# EAGLE design Variable_Load (EAGLE 7.7.0)
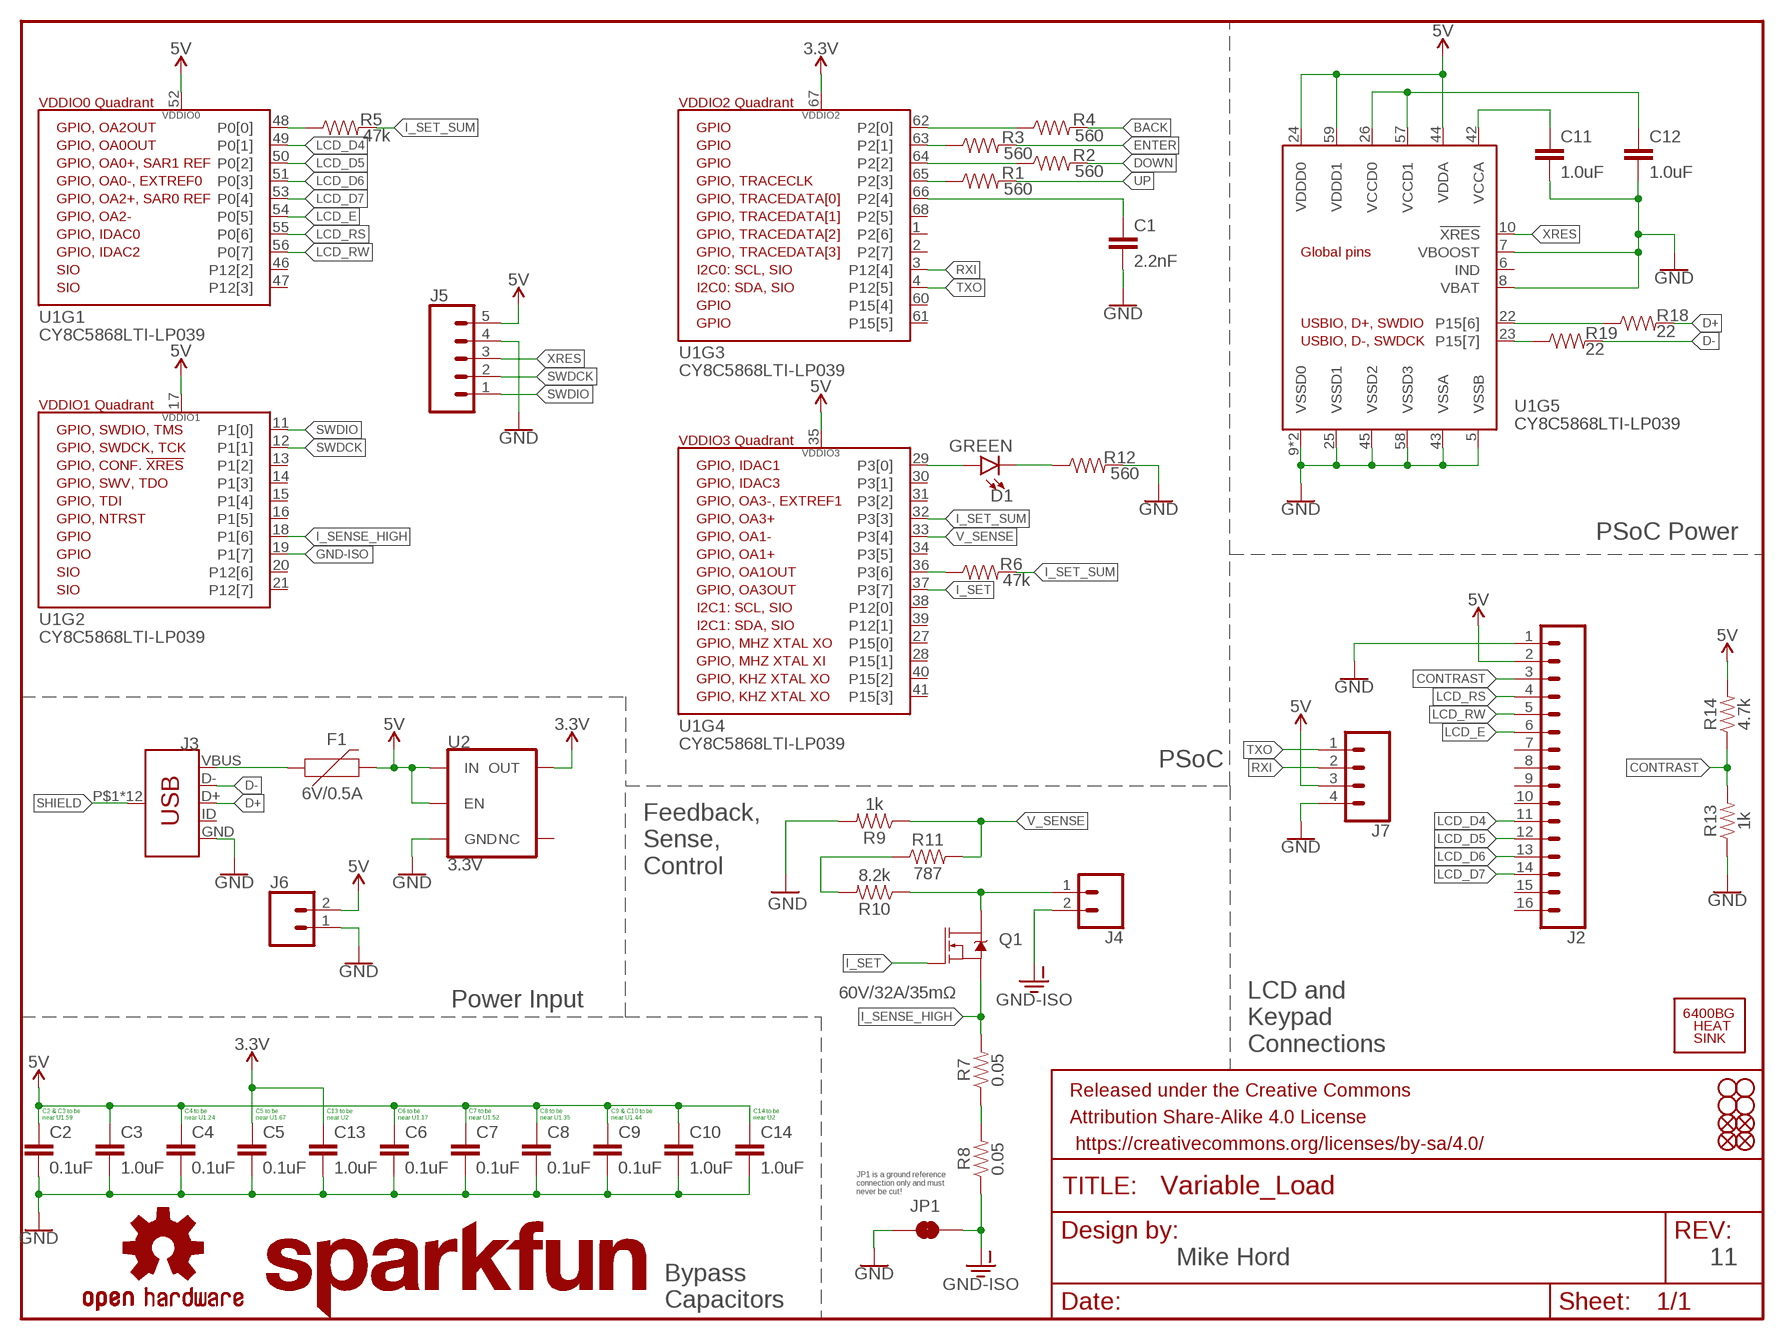
[diagram p0: schematic, sheet 1]

## Parts
C1  2.2nF  2.2NF/2200PF-0603-50V-10%  [0603]
C2  0.1uF  0.1UF-0402-16V-10%  [0402]
C3  1.0uF  1.0UF-0402-16V-10%  [0402]
C4  0.1uF  0.1UF-0402-16V-10%  [0402]
C5  0.1uF  0.1UF-0402-16V-10%  [0402]
C6  0.1uF  0.1UF-0402-16V-10%  [0402]
C7  0.1uF  0.1UF-0402-16V-10%  [0402]
C8  0.1uF  0.1UF-0402-16V-10%  [0402]
C9  0.1uF  0.1UF-0402-16V-10%  [0402]
C10  1.0uF  1.0UF-0402-16V-10%  [0402]
C11  1.0uF  1.0UF-0402-16V-10%  [0402]
C12  1.0uF  1.0UF-0402-16V-10%  [0402]
C13  1.0uF  1.0UF-0402-16V-10%  [0402]
C14  1.0uF  1.0UF-0402-16V-10%  [0402]
D1  GREEN  LED1206-BOTTOM  [LED-1206-BOTTOM]
F1  6V/0.5A  PPTC_HALF-AMP  [1206]
FD1  FIDUCIAL1X2  [FIDUCIAL-1X2]
FD2  FIDUCIAL1X2  [FIDUCIAL-1X2]
FD3  FIDUCIAL1X2  [FIDUCIAL-1X2]
FD4  FIDUCIAL1X2  [FIDUCIAL-1X2]
FRAME1  FRAME-LETTER  [CREATIVE_COMMONS]
H1  6400BG_HEATSINK  [6400BG_HEATSINK]
H2  STAND-OFF  [STAND-OFF]
H3  STAND-OFF  [STAND-OFF]
H4  STAND-OFF  [STAND-OFF]
H5  STAND-OFF  [STAND-OFF]
J2  CONN_16  [1X16]
J3  AMP FCI 10103594-0001LF  USB_MICRO-B_HALF_PTH  [USB-MICROB-PTH]
J4  CONN_023.5MM_LOCK  [SCREWTERMINAL-3.5MM-2_LOCK]
J5  CONN_05  [1X05]
J6  CONN_02  [1X02]
J7  CONN_04  [1X04]
JP1  JUMPER-SMT_2_NC_TRACE_NO-SILK  [SMT-JUMPER_2_NC_TRACE_NO-SILK]
LOGO1  OSHW-LOGOM  [OSHW-LOGO-M]
LOGO2  SFE_LOGO_NAME.3_INCH  [SFE_LOGO_NAME_.3]
LOGO3  SFE_LOGO_NAME.3_INCH  [SFE_LOGO_NAME_.3]
Q1  60V/32A/35mΩ  MOSFET-NCH-FQP30N06L  [TO220V]
R1  560  560OHM_0402_1%  [0402]
R2  560  560OHM_0402_1%  [0402]
R3  560  560OHM_0402_1%  [0402]
R4  560  560OHM_0402_1%  [0402]
R5  47k  47KOHM-0603-1/10W-1%  [0603]
R6  47k  47KOHM-0603-1/10W-1%  [0603]
R7  0.05  0.05OHM-2512-3W-1%  [2512]
R8  0.05  0.05OHM-2512-3W-1%  [2512]
R9  1k  1KOHM-0603-1/10W-1%  [0603]
R10  8.2k  8.2KOHM-0603-1/10W-5%  [0603]
R11  787  787OHM-0603-1/10W-1%  [0603]
R12  560  560OHM_0402_1%  [0402]
R13  1k  1KOHM-0603-1/10W-1%  [0603]
R14  4.7k  4.7KOHM-0603-1/10W-1%  [0603]
R18  22  22OHM1/10W1%(0402)  [0402-RES]
R19  22  22OHM1/10W1%(0402)  [0402-RES]
U1  CY8C5868LTI-LP039  PSOC_5LP_68QFN  [QFN-68]
U2  3.3V  V_REG_AP2112K-3.3V  [SOT23-5]

## Nets
3.3V: C5.1 C13.1 U1.67(VDDIO2) U2.5(OUT)
5V: C2.1 C3.1 C4.1 C6.1 C7.1 C8.1 C9.1 C10.1 C14.1 F1.2 J2.2 J5.5 J6.2 J7.3 R14.2 U1.17(VDDIO1) U1.24(VDDD0) U1.35(VDDIO3) U1.44(VDDA) U1.52(VDDIO0) U1.59(VDDD1) U2.1(IN) U2.3(EN)
BACK: R4.2
CONTRAST: J2.3 R13.2 R14.1
D+: J3.D+ R18.2
D-: J3.D- R19.2
DOWN: R2.2
ENTER: R3.2
GND: C1.2 C2.2 C3.2 C4.2 C5.2 C6.2 C7.2 C8.2 C9.2 C10.2 C11.2 C12.2 C13.2 C14.2 J2.1 J3.GND J5.4 J6.1 J7.4 JP1.1 R9.2 R12.2 R13.1 U1.5(VSSB) U1.7(VBOOST) U1.8(VBAT) U1.9(VSSD0) U1.25(VSSD1) U1.43(VSSA) U1.45(VSSD2) U1.58(VSSD3) U1.69(VSSD0) U2.2(GND)
GND-ISO: J4.2 JP1.2 R8.P$1 U1.19(P1[7])
I_SENSE_HIGH: Q1.3(S) R7.P$2 U1.18(P1[6])
I_SET: Q1.1(G) U1.37(P3[7])
I_SET_SUM: R5.2 R6.2 U1.32(P3[3])
LCD_D4: J2.11 U1.49(P0[1])
LCD_D5: J2.12 U1.50(P0[2])
LCD_D6: J2.13 U1.51(P0[3])
LCD_D7: J2.14 U1.53(P0[4])
LCD_E: J2.6 U1.54(P0[5])
LCD_RS: J2.4 U1.55(P0[6])
LCD_RW: J2.5 U1.56(P0[7])
N$1: R1.1 U1.65(P2[3])
N$2: R2.1 U1.64(P2[2])
N$3: R3.1 U1.63(P2[1])
N$4: R4.1 U1.62(P2[0])
N$5: C1.1 U1.66(P2[4])
N$6: C12.1 U1.26(VCCD0) U1.57(VCCD1)
N$7: C11.1 U1.42(VCCA)
N$8: R18.1 U1.22(P15[6])
N$9: R19.1 U1.23(P15[7])
N$10: R5.1 U1.48(P0[0])
N$11: R6.1 U1.36(P3[6])
N$12: D1.A U1.29(P3[0])
N$13: D1.C R12.1
N$14: F1.1 J3.VBUS
N$15: J4.1 Q1.2(D) R10.1
N$16: R10.2 R11.1
N$18: R7.P$1 R8.P$2
RXI: J7.2 U1.3(P12[4])
SHIELD: J3.P$1(SHIELD) J3.P$2(SHIELD) J3.P$3(SHIELD) J3.P$4(SHIELD) J3.P$6(SHIELD) J3.P$8(SHIELD) J3.P$10(SHIELD) J3.P$12(SHIELD) J3.SHEILD2(SHIELD) J3.SHIELD J3.SHIELD3(SHIELD) J3.SHIELD4(SHIELD)
SWDCK: J5.2 U1.12(P1[1])
SWDIO: J5.1 U1.11(P1[0])
TXO: J7.1 U1.4(P12[5])
UP: R1.2
V_SENSE: R9.1 R11.2 U1.33(P3[4])
XRES: J5.3 U1.10(!XRES)
Unconnected: J2.7 J2.8 J2.9 J2.10 J2.15 J2.16 J3.ID U1.1(P2[6]) U1.2(P2[7]) U1.6(IND) U1.13(P1[2]) U1.14(P1[3]) U1.15(P1[4]) U1.16(P1[5]) U1.20(P12[6]) U1.21(P12[7]) U1.27(P15[0]) U1.28(P15[1]) U1.30(P3[1]) U1.31(P3[2]) U1.34(P3[5]) U1.38(P12[0]) U1.39(P12[1]) U1.40(P15[2]) U1.41(P15[3]) U1.46(P12[2]) U1.47(P12[3]) U1.60(P15[4]) U1.61(P15[5]) U1.68(P2[5]) U2.4(NC)

## Notes on the sheet
- PSoC Power
- PSoC
- Feedback,
  Sense,
  Control
- Power Input
- LCD and
  Keypad
  Connections
- C2 & C3 to be
  near U1.59
- C4 to be
  near U1.24
- C5 to be
  near U1.67
- C13 to be
  near U2
- C6 to be
  near U1.17
- C7 to be
  near U1.52
- C8 to be
  near U1.35
- C9 & C10 to be
  near U1.44
- C14 to be
  near U2
- JP1 is a ground reference 
  connection only and must
  never be cut!
- Mike Hord | 11
- Bypass
  Capacitors

## Library data of the parts
C1 = SparkFun-Capacitors:2.2NF/2200PF: 2.2nF/2,200pF ceramic capacitors A capacitor is a passive two-terminal electrical component used to store electrical energy temporarily in an electric field.; PROD_ID: CAP-07877
C2 C4-C9 = SparkFun-Capacitors:0.1UF: 0.1µF ceramic capacitors A capacitor is a passive two-terminal electrical component used to store electrical energy temporarily in an electric field.; PROD_ID: CAP-12416
C3 C10-C14 = SparkFun-Capacitors:1.0UF: 1µF ceramic capacitors A capacitor is a passive two-terminal electrical component used to store electrical energy temporarily in an electric field.; PROD_ID: CAP-12417
D1 = SparkFun-LED:LED: LED (Generic) Standard schematic elements and footprints for 5mm, 3mm, 1206, and 0603 sized LEDs. Generic LEDs with no color specified.; PROD_ID: DIO-11076
F1 = SparkFun-Fuses:PPTC: Resettable Fuse PPTC Resettable Fuse. Really a sort of resistor with a polymeric positive temperature coefficient whose resistance increases dramatically with an increase in temperature. When heated by the power passing through the resistance rises causing the current to be limited, protecting the circuit. This is achieved by the transition of the polymer from a crystalline to an amorphous state where the conductive carbon separates breaking the conductive pathways found in the cool crystalline structure. When a PPTC cools back down it resumes conducting letting the circuit turn back on. SparkFun Products: SparkFun RedBoard - Programmed with Arduino <https://www.sparkfun.com/products/12757> Pro Micro - 5V/16MHz <https://www.sparkfun.com/products/12640> Arduino Pro 328 - 5V/16MHz <https://www.sparkfun.com/products/10915> MP3 Trigger <https://www.sparkfun.com/products/13720>; PROD_ID: RES-08585
FD1-FD4 = SparkFun-Aesthetics:FIDUCIAL: Fiducial Alignment Points Point-of-reference for pick-and-place machines and other optical instruments.
FRAME1 = SparkFun-Aesthetics:FRAME-LETTER: Schematic Frame - Letter Standard 8.5x11 US Letter frame
H1 = SparkFun-Hardware:6400BG_HEATSINK: 6400BG Heatsink - Multiwatt Package This beefy heatsink is designed to dissipate a lot of heat! The 6400BG heatsink fits TO-220, TO-218, TO-247, and Multiwatt packages - which means it’s a great fit for the STA540 <http://www.sparkfun.com/commerce/product_info.php?products_id=9557>, L298N <http://www.sparkfun.com/commerce/product_info.php?products_id=9479>, and all of our T-220 package voltage regulators <http://www.sparkfun.com/commerce/advanced_search_result.php?keywords=TO-220+COM&x=21&y=16&search_section=products>. SparkFun Products Heat Sink - Multiwatt Package <https://www.sparkfun.com/products/9576> (PRT-09576); PROD_ID: COMP-09537; SF_SKU: PRT-09576
H2-H5 = SparkFun-Hardware:STAND-OFF: Stand Off Drill holes for mechanically mounting via screws, standoffs, etc. Note: Use the keepout ring to avoid running the screw head into surrounding components. Variant Overviews STAND-OFF - Mechanical footprint for a #4 phillips button head screw. STAND-OFF-TIGHT - Mechanical footprint for a #4 phillips button head screw, Example SparkFun Products Screw - Phillips Head (1/4", 4-40, 10 pack) <https://www.sparkfun.com/products/10453> (PRT-10453) Screw - Phillips Head (1/2", 4-40, 10 pack) <https://www.sparkfun.com/products/10452> (PRT-10452) Screw - Phillips Head (3/4", 4-40, 10 pack) <https://www.sparkfun.com/products/10451> (PRT-10451) Screw - Phillips Head (1", 4-40, 10 pack) <https://www.sparkfun.com/products/10450> (PRT-10450)
J2 = SparkFun-Connectors:CONN_16: Multi connection point. Often used as Generic Header-pin footprint for 0.1 inch spaced/style header connections On any of the 0.1 inch spaced packages, you can populate with these: Break Away Headers - Straight <https://www.sparkfun.com/products/116> (PRT-00116) Break Away Male Headers - Right Angle <https://www.sparkfun.com/products/553> (PRT-00553) Female Headers <https://www.sparkfun.com/products/115> (PRT-00115) Break Away Headers - Machine Pin <https://www.sparkfun.com/products/117> (PRT-00117) Break Away Female Headers - Swiss Machine Pin <https://www.sparkfun.com/products/743> (PRT-00743) For SCREWTERMINALS and SPRING TERMINALS visit here: Screw Terimnals on SparkFun.com <https://www.sparkfun.com/search/results?term=Screw+Terminals> (5mm/3.5mm/2.54mm spacing) This device is also useful as a general connection point to wire up your design to another part of your project. Our various solder wires solder well into these plated through hole pads. Hook-Up Wire - Assortment (Stranded, 22 AWG) <https://www.sparkfun.com/products/11375> (PRT-11375) Hook-Up Wire - Assortment (Solid Core, 22 AWG) <https://www.sparkfun.com/products/11367> (PRT-11367) View the entire wire category on our website here <https://www.sparkfun.com/categories/141> Special notes: Molex polarized connector foot print use with SKU : PRT-08231 with associated crimp pins and housings. 1MM SMD Version SKU: PRT-10208 NOTES ON THE VARIANTS LOCK and LOCK_LONGPADS... This footprint was designed to help hold the alignment of a through-hole component (i.e. 6-pin header) while soldering it into place. You may notice that each hole has been shifted either up or down by 0.005 of an inch from it's more standard position (which is a perfectly straight line). This slight alteration caused the pins (the squares in the middle) to touch the edges of the holes. Because they are alternating, it causes a "brace" to hold the component in place. 0.005 has proven to be the perfect amount of "off-center" position when using our standard breakaway headers. Although looks a little odd when you look at the bare footprint, once you have a header in there, the alteration is very hard to notice. Also,if you push a header all the way into place, it is covered up entirely on the bottom side.
J3 = SparkFun-Connectors:USB_MICRO-B: USB Type Micro-B Connector Male/female and PTH/SMT variants SparkFun Products: SparkFun microB USB Breakout <https://www.sparkfun.com/products/12035> SparkFun USB microB Plug Breakout <https://www.sparkfun.com/products/10031> SparkFun ESP8266 Thing <https://www.sparkfun.com/products/13231>; PROD_ID: CONN-13711
J4 = SparkFun-Connectors:CONN_02: Multi connection point. Often used as Generic Header-pin footprint for 0.1 inch spaced/style header connections On any of the 0.1 inch spaced packages, you can populate with these: Break Away Headers - Straight <https://www.sparkfun.com/products/116> (PRT-00116) Break Away Male Headers - Right Angle <https://www.sparkfun.com/products/553> (PRT-00553) Female Headers <https://www.sparkfun.com/products/115> (PRT-00115) Break Away Headers - Machine Pin <https://www.sparkfun.com/products/117> (PRT-00117) Break Away Female Headers - Swiss Machine Pin <https://www.sparkfun.com/products/743> (PRT-00743) For SCREWTERMINALS and SPRING TERMINALS visit here: Screw Terimnals on SparkFun.com <https://www.sparkfun.com/search/results?term=Screw+Terminals> (5mm/3.5mm/2.54mm spacing) This device is also useful as a general connection point to wire up your design to another part of your project. Our various solder wires solder well into these plated through hole pads. Hook-Up Wire - Assortment (Stranded, 22 AWG) <https://www.sparkfun.com/products/11375> (PRT-11375) Hook-Up Wire - Assortment (Solid Core, 22 AWG) <https://www.sparkfun.com/products/11367> (PRT-11367) View the entire wire category on our website here <https://www.sparkfun.com/categories/141> Special notes: Molex polarized connector foot print use with: PRT-08233 with associated crimp pins and housings. 2.54_SCREWTERM for use with PRT-10571. 3.5mm Screw Terminal footprints for PRT-08084 5mm Screw Terminal footprints for use with PRT-08432; PROD_ID: CONN-08399
J5 = SparkFun-Connectors:CONN_05: Multi connection point. Often used as Generic Header-pin footprint for 0.1 inch spaced/style header connections On any of the 0.1 inch spaced packages, you can populate with these: Break Away Headers - Straight <https://www.sparkfun.com/products/116> (PRT-00116) Break Away Male Headers - Right Angle <https://www.sparkfun.com/products/553> (PRT-00553) Female Headers <https://www.sparkfun.com/products/115> (PRT-00115) Break Away Headers - Machine Pin <https://www.sparkfun.com/products/117> (PRT-00117) Break Away Female Headers - Swiss Machine Pin <https://www.sparkfun.com/products/743> (PRT-00743) For SCREWTERMINALS and SPRING TERMINALS visit here: Screw Terimnals on SparkFun.com <https://www.sparkfun.com/search/results?term=Screw+Terminals> (5mm/3.5mm/2.54mm spacing) This device is also useful as a general connection point to wire up your design to another part of your project. Our various solder wires solder well into these plated through hole pads. Hook-Up Wire - Assortment (Stranded, 22 AWG) <https://www.sparkfun.com/products/11375> (PRT-11375) Hook-Up Wire - Assortment (Solid Core, 22 AWG) <https://www.sparkfun.com/products/11367> (PRT-11367) View the entire wire category on our website here <https://www.sparkfun.com/categories/141> Special notes: Molex polarized connector foot print use with SKU : PRT-08231 with associated crimp pins and housings. 1MM SMD Version SKU: PRT-10208
J6 = SparkFun-Connectors:CONN_02: Multi connection point. Often used as Generic Header-pin footprint for 0.1 inch spaced/style header connections On any of the 0.1 inch spaced packages, you can populate with these: Break Away Headers - Straight <https://www.sparkfun.com/products/116> (PRT-00116) Break Away Male Headers - Right Angle <https://www.sparkfun.com/products/553> (PRT-00553) Female Headers <https://www.sparkfun.com/products/115> (PRT-00115) Break Away Headers - Machine Pin <https://www.sparkfun.com/products/117> (PRT-00117) Break Away Female Headers - Swiss Machine Pin <https://www.sparkfun.com/products/743> (PRT-00743) For SCREWTERMINALS and SPRING TERMINALS visit here: Screw Terimnals on SparkFun.com <https://www.sparkfun.com/search/results?term=Screw+Terminals> (5mm/3.5mm/2.54mm spacing) This device is also useful as a general connection point to wire up your design to another part of your project. Our various solder wires solder well into these plated through hole pads. Hook-Up Wire - Assortment (Stranded, 22 AWG) <https://www.sparkfun.com/products/11375> (PRT-11375) Hook-Up Wire - Assortment (Solid Core, 22 AWG) <https://www.sparkfun.com/products/11367> (PRT-11367) View the entire wire category on our website here <https://www.sparkfun.com/categories/141> Special notes: Molex polarized connector foot print use with: PRT-08233 with associated crimp pins and housings. 2.54_SCREWTERM for use with PRT-10571. 3.5mm Screw Terminal footprints for PRT-08084 5mm Screw Terminal footprints for use with PRT-08432
J7 = SparkFun-Connectors:CONN_04: Multi connection point. Often used as Generic Header-pin footprint for 0.1 inch spaced/style header connections On any of the 0.1 inch spaced packages, you can populate with these: Break Away Headers - Straight <https://www.sparkfun.com/products/116> (PRT-00116) Break Away Male Headers - Right Angle <https://www.sparkfun.com/products/553> (PRT-00553) Female Headers <https://www.sparkfun.com/products/115> (PRT-00115) Break Away Headers - Machine Pin <https://www.sparkfun.com/products/117> (PRT-00117) Break Away Female Headers - Swiss Machine Pin <https://www.sparkfun.com/products/743> (PRT-00743) For SCREWTERMINALS and SPRING TERMINALS visit here: Screw Terimnals on SparkFun.com <https://www.sparkfun.com/search/results?term=Screw+Terminals> (5mm/3.5mm/2.54mm spacing) This device is also useful as a general connection point to wire up your design to another part of your project. Our various solder wires solder well into these plated through hole pads. Hook-Up Wire - Assortment (Stranded, 22 AWG) <https://www.sparkfun.com/products/11375> (PRT-11375) Hook-Up Wire - Assortment (Solid Core, 22 AWG) <https://www.sparkfun.com/products/11367> (PRT-11367) View the entire wire category on our website here <https://www.sparkfun.com/categories/141> Special notes: Molex polarized connector foot print use with SKU : PRT-08231 with associated crimp pins and housings. 1MM SMD Version SKU: PRT-10208; PROD_ID: CONN-09696
JP1 = SparkFun-Jumpers:JUMPER-SMT_2_NC_TRACE: Normally closed trace jumper This jumper has a trace between two pads so it's normally closed (NC). Use a razor knife to open the connection. For best results follow the IPC guidelines for cutting traces: Cutout at least 0.063 mm (0.005 in). Remove all loose material to clean up the cut area. Seal the cut with an approved epoxy. Reapply solder to reclose the connection.
LOGO1 = SparkFun-Aesthetics:OSHW-LOGO: Open-Source Hardware (OSHW) Logo This logo indicates the piece of hardware it is found on incorporates a OSHW license and/or adheres to the definition of open source hardware found here: http://freedomdefined.org/OSHW
LOGO2 LOGO3 = SparkFun-Aesthetics:SFE_LOGO_NAME: SparkFun Font Logo This is the SparkFun name logo. The logo on the schematic will always be the same size; the package variant is the height of the flame part of the logo (or the height the flame would be, if it were drawn). Default layer for the logo on the board is tSilk.
Q1 = SparkFun-DiscreteSemi:MOSFET-NCH: N-channel MOSFETs Voltage controlled devices that allow control of high current outputs. SparkFun Products: SparkFun OpenScale <https://www.sparkfun.com/products/13261> SparkFun Digital Sandbox <https://www.sparkfun.com/products/12651> SparkFun Monster Moto Shield <https://www.sparkfun.com/products/10182> SparkFun MOSFET Power Controller <https://www.sparkfun.com/products/11214>; PROD_ID: TRANS-10060
R1-R4 R12 = SparkFun-Resistors:560OHM; PROD_ID: RES-13766
R5 R6 = SparkFun-Resistors:47KOHM: 47kΩ resistor A resistor is a passive two-terminal electrical component that implements electrical resistance as a circuit element. Resistors act to reduce current flow, and, at the same time, act to lower voltage levels within circuits. - Wikipedia; PROD_ID: RES-07871
R7 R8 = SparkFun-Resistors:0.05OHM: 0.05Ω resistor A resistor is a passive two-terminal electrical component that implements electrical resistance as a circuit element. Resistors act to reduce current flow, and, at the same time, act to lower voltage levels within circuits. - Wikipedia; PROD_ID: RES-13771
R9 R13 = SparkFun-Resistors:1KOHM: 1kΩ resistor A resistor is a passive two-terminal electrical component that implements electrical resistance as a circuit element. Resistors act to reduce current flow, and, at the same time, act to lower voltage levels within circuits. - Wikipedia; PROD_ID: RES-07856
R10 = SparkFun-Resistors:8.2KOHM: 8.2kΩ resistor A resistor is a passive two-terminal electrical component that implements electrical resistance as a circuit element. Resistors act to reduce current flow, and, at the same time, act to lower voltage levels within circuits. - Wikipedia; PROD_ID: RES-10646
R11 = SparkFun-Resistors:787OHM: 787Ω resistor A resistor is a passive two-terminal electrical component that implements electrical resistance as a circuit element. Resistors act to reduce current flow, and, at the same time, act to lower voltage levels within circuits. - Wikipedia; PROD_ID: RES-11228
R14 = SparkFun-Resistors:4.7KOHM: 4.7kΩ resistor A resistor is a passive two-terminal electrical component that implements electrical resistance as a circuit element. Resistors act to reduce current flow, and, at the same time, act to lower voltage levels within circuits. - Wikipedia; PROD_ID: RES-07857
R18 R19 = SparkFun-Resistors:22OHM1/10W1%(0402); PROD_ID: RES-12427
U1 = SparkFun-IC-Microcontroller:PSOC_5LP_68QFN: PSoC5LP 68-QFN package CY8C5868LTI-LP039 PSOC 5LP 256K/64K/2K 80MHz Datasheet <https://cdn.sparkfun.com/datasheets/Dev/ARM/CY8C58LP_001-84932_0H_V.pdf> SparkFun Products FreeSoC2 Development Board - PSoC5LP <https://www.sparkfun.com/products/13229> (DEV-13229) -- Involved with change to new unposted revision; PROD_ID: IC-12391
U2 = SparkFun-IC-Power:V_REG_AP2112: AP2112 - 600mA CMOS LDO Regulator w/ Enable The AP2112 is CMOS process low dropout linear regulator with enable function, the regulator delivers a guaranteed 600mA (min.) continuous load current. Features Output Voltage Accuracy: ±1.5% Output Current: 600mA (Min.) Foldback Short Current Protection: 50mA Enable Function to Turn ON/OFF VOUT Low Dropout Voltage (3.3V): 250mV (Typ.) @IOUT=600mA Excellent Load Regulation: 0.2%/A (Typ.) Excellent Line Regulation: 0.02%/V (Typ.) Low Quiescent Current: 55μA (Typ.) Low Standby Current: 0.01μA (Typ.) Low Output Noise: 50μVRMS PSRR: 100Hz -65dB, 1kHz -65dB OTSD Protection Stable with 1.0μF Flexible Cap: Ceramic, Tantalum and Aluminum Electrolytic Operation Temperature Range: -40°C to 85°C ESD: MM 400V, HBM 4000V; PROD_ID: VREG-12457

## Board
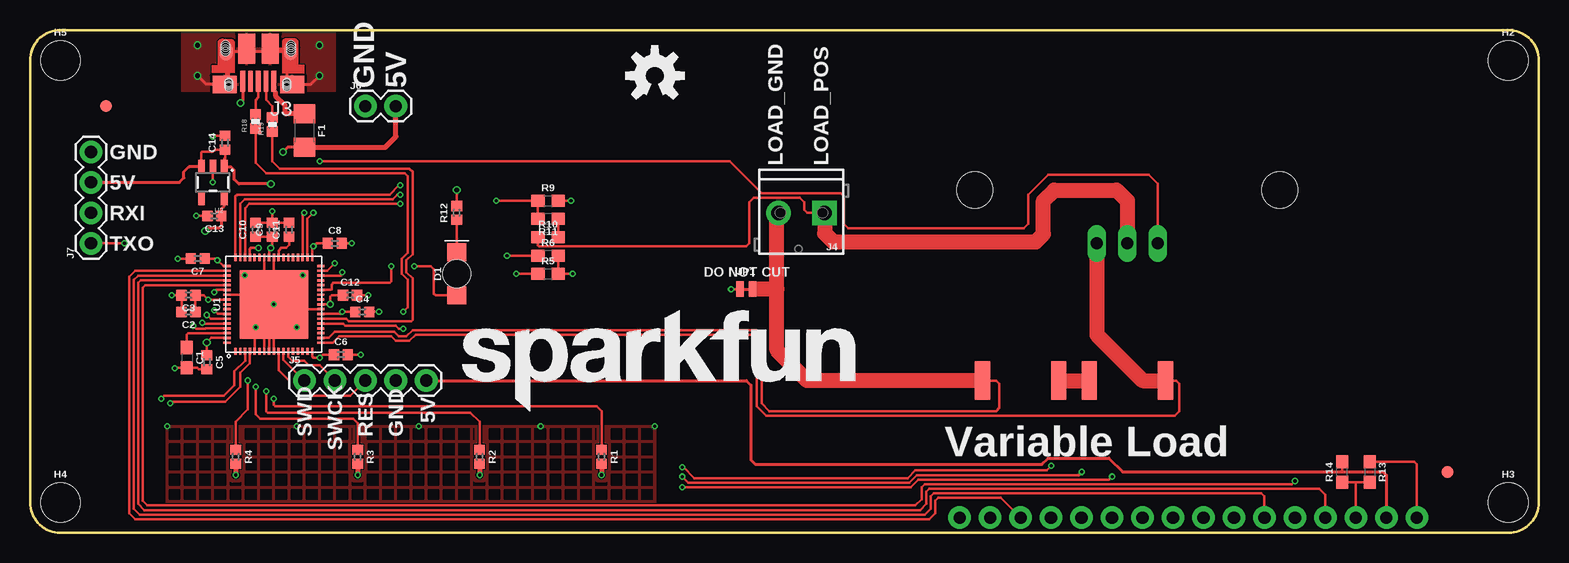
[diagram p1: board, top side]
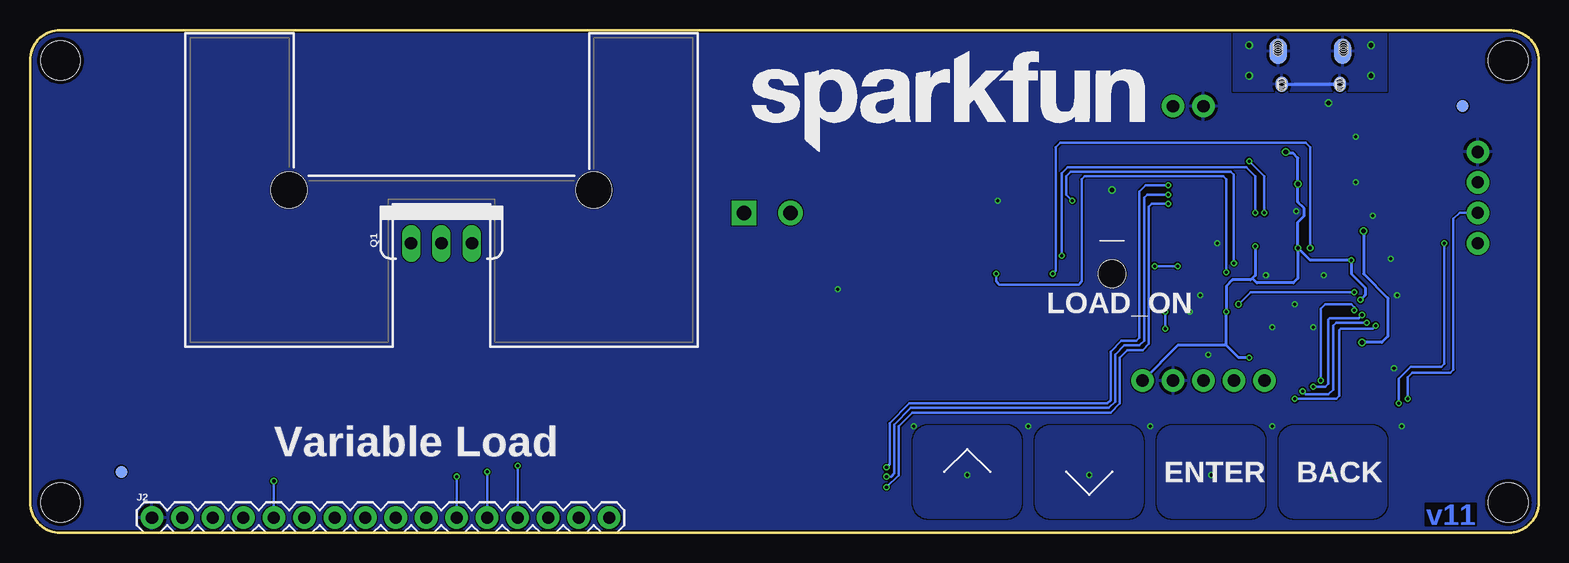
[diagram p2: board, bottom side, seen from below]

Size 125.73 x 41.91 mm. Coordinates in mm from the lower left corner, seen from the top.
Outline: 2.54,0 123.19,0 arc90 125.73,2.54 125.73,39.37 arc90 123.19,41.91 2.54,41.91 arc90 0,39.37 0,2.54 arc90 2.54,0
Copper layers (1*16): Top 0.035mm / dielectric 1.5mm / Bottom 0.035mm
Design rules "SparkFun-2-layer-FAB-LIMIT": minimum track width 4mil, minimum drill 6mil, track to track 4mil, track to pad 4mil, pad to pad 4mil, via to via 4mil, smd to smd 4mil, copper to edge 4mil, drill to drill 4mil, minimum pad ring 5mil, minimum via ring 5mil, stop-mask expansion 4mil, vias tented up to drill 25mil, thermal gap 10mil
tRestrict: 1 lines

### Footprints (pad centres in the part's own frame; a part is rotated, then mirrored left to right if it is on the bottom)
0603 = smd 1.1 x 1: 1 -0.85,0; 2 0.85,0
0402 = smd 0.85 x 0.9: 1 -0.58,0; 2 0.58,0
LED-1206-BOTTOM = smd 1.5 x 1.6: A -1.8,0; C 1.8,0 | hole 2.3: 0,0
1206 = smd 1.6 x 1.8: 1 -1.4,0; 2 1.4,0
FIDUCIAL-1X2 = smd 1 x 1: 1 0,0
6400BG_HEATSINK = hole 2.997: -12.7,0; 12.7,0
STAND-OFF = hole 3.302: 0,0
1X16 = drill 1.016 pad 1.88: 1 0,0; 2 2.54,0; 3 5.08,0; 4 7.62,0; 5 10.16,0; 6 12.7,0; 7 15.24,0; 8 17.78,0; 9 20.32,0; 10 22.86,0; 11 25.4,0; 12 27.94,0; 13 30.48,0; 14 33.02,0; 15 35.56,0; 16 38.1,0
USB-MICROB-PTH = smd 0.4 x 1.75: D+ 0.031,1.331; D- -0.619,1.331; GND 1.331,1.331; ID 0.681,1.331; VBUS -1.269,1.331 | smd 1.4 x 2.1 bottom: P$1 2.701,-1.142; P$3 -2.659,-1.144 | smd 1 x 1.3: P$2 2.487,1.594; P$6 -2.368,1.604 | smd 1 x 1.3 bottom: P$4 -2.368,1.604; P$10 2.481,1.598 | smd 1.1 x 1.5: P$8 2.701,-1.142; P$12 -2.659,-1.144 | smd 2 x 1.46: SHEILD2 2.831,1.606; SHIELD -2.794,1.606 | smd 1.425 x 2.5: SHIELD3 -0.979,-1.349; SHIELD4 0.996,-1.352 | hole 0.7: -2.693,-1.134; -2.693,-1.3; -2.694,-1.499; -2.694,-1.664; 2.768,-1.134; 2.767,-1.303; 2.766,-1.496; 2.766,-1.664 | hole 0.66: -2.359,1.821; -2.349,1.691; -2.359,1.541; -2.354,1.432; 2.481,1.821; 2.491,1.691; 2.481,1.541; 2.486,1.432
SCREWTERMINAL-3.5MM-2_LOCK = drill 1.2 pad 2.032 square: 1 -0.178,0 | drill 1.2 pad 2.032: 2 3.678,0
1X05 = drill 1.016 pad 1.88: 1 0,0; 2 2.54,0; 3 5.08,0; 4 7.62,0; 5 10.16,0
1X02 = drill 1.016 pad 1.88: 1 0,0; 2 2.54,0
1X04 = drill 1.016 pad 1.88: 1 0,0; 2 2.54,0; 3 5.08,0; 4 7.62,0
SMT-JUMPER_2_NC_TRACE_NO-SILK = smd 0.635 x 1.27: 1 -0.508,0; 2 0.508,0
TO220V = drill 1.016 long: 1 -2.54,0; 2 0,0; 3 2.54,0
2512 = smd 1.27 x 3.175: P$1 -3.175,0; P$2 3.175,0
0402-RES = smd 0.85 x 0.9: 1 -0.58,0; 2 0.58,0
QFN-68 = smd 0.6 x 0.2: 1 -3.9,3.2; 2 -3.9,2.8; 3 -3.9,2.4; 4 -3.9,2; 5 -3.9,1.6; 6 -3.9,1.2; 7 -3.9,0.8; 8 -3.9,0.4; 9 -3.9,0; 10 -3.9,-0.4; 11 -3.9,-0.8; 12 -3.9,-1.2; 13 -3.9,-1.6; 14 -3.9,-2; 15 -3.9,-2.4; 16 -3.9,-2.8; 17 -3.9,-3.2; 35 3.9,-3.2; 36 3.9,-2.8; 37 3.9,-2.4; 38 3.9,-2; 39 3.9,-1.6; 40 3.9,-1.2; 41 3.9,-0.8; 42 3.9,-0.4; 43 3.9,0; 44 3.9,0.4; 45 3.9,0.8; 46 3.9,1.2; 47 3.9,1.6; 48 3.9,2; 49 3.9,2.4; 50 3.9,2.8; 51 3.9,3.2 | smd 0.2 x 0.6: 18 -3.2,-3.9; 19 -2.8,-3.9; 20 -2.4,-3.9; 21 -2,-3.9; 22 -1.6,-3.9; 23 -1.2,-3.9; 24 -0.8,-3.9; 25 -0.4,-3.9; 26 0,-3.9; 27 0.4,-3.9; 28 0.8,-3.9; 29 1.2,-3.9; 30 1.6,-3.9; 31 2,-3.9; 32 2.4,-3.9; 33 2.8,-3.9; 34 3.2,-3.9; 52 3.2,3.9; 53 2.8,3.9; 54 2.4,3.9; 55 2,3.9; 56 1.6,3.9; 57 1.2,3.9; 58 0.8,3.9; 59 0.4,3.9; 60 0,3.9; 61 -0.4,3.9; 62 -0.8,3.9; 63 -1.2,3.9; 64 -1.6,3.9; 65 -2,3.9; 66 -2.4,3.9; 67 -2.8,3.9; 68 -3.2,3.9 | smd 5.7 x 5.7: 69 0,0
SOT23-5 = smd 0.55 x 1.2: 1 -0.95,-1.3; 2 0,-1.3; 3 0.95,-1.3; 4 0.95,1.3; 5 -0.95,1.3

### Placement (x,y rotation side)
C1  13.08,14.61 270 top
C2  13.21,18.41 180 top
C3  13.21,19.81 180 top
C4  27.69,18.41 0 top
C5  14.73,14.22 270 top
C6  25.91,14.86 0 top
C7  13.97,22.86 180 top
C8  25.4,24.13 0 top
C9  20.19,25.27 90 top
C10  18.8,25.27 90 top
C11  21.59,25.27 90 top
C12  26.67,19.81 0 top
C13  15.37,26.42 180 top
C14  16.26,32.51 90 top
D1  35.56,21.59 90 top
F1  22.86,33.53 270 top
FD1  118.11,5.08 0 bottom
FD2  6.35,35.56 0 bottom
FD3  118.11,5.08 0 top
FD4  6.35,35.56 0 top
FRAME1  22.86,-24.13 0 top  (outside the outline)
H1  91.44,28.57 180 bottom
H2  123.19,39.37 0 top
H3  123.19,2.54 0 top
H4  2.54,2.54 0 top
H5  2.54,39.37 0 top
J2  115.57,1.27 0 bottom
J3  19.05,38.99 180 top
J4  66.04,26.67 180 top
J5  22.86,12.7 0 top
J6  27.94,35.56 0 top
J7  5.08,24.13 90 top
JP1  59.69,20.32 0 top
LOGO1  52.07,38.1 0 top
LOGO2  35.56,10.16 0 top
LOGO3  66.04,31.75 0 bottom
Q1  91.44,24.13 0 bottom
R1  47.62,6.35 270 top
R2  37.47,6.35 270 top
R3  27.3,6.35 270 top
R4  17.14,6.35 270 top
R5  43.18,21.59 0 top
R6  43.18,23.11 0 top
R7  91.44,12.7 0 top
R8  82.55,12.7 0 top
R9  43.18,27.69 0 top
R10  43.18,24.64 0 top
R11  43.18,26.16 180 top
R12  35.56,26.67 90 top
R13  111.63,5.08 270 top
R14  109.35,5.08 90 top
R18  18.8,34.29 90 top
R19  20.19,34.04 90 top
U1  20.32,19.05 90 top
U2  15.24,29.21 180 top

### Tracks (layer width: path | path; a pad name or v marks a point on that pad's centre or on a via)
3.3V  (via drill 0.38)
  Top 0.203: C5.1 v14.73,15.88 15.11,16.26 U1.67 | U2.5 16.19,27.24 15.95,27 C13.1
  Top 0.254: C13.1 15.95,25.6 15.75,25.4 14.86,25.4 v14.61,25.15
  Bottom 0.254: v14.61,25.15 14.61,21.59 12.57,19.56 12.57,16.38 13.08,15.88 v14.73,15.88
5V  (via drill 0.25, 0.3, 0.38)
  Top 0.203: U1.44 19.92,23.6 v20.07,23.75 20.19,23.88 C9.1 C10.1 | U1.24 25.87,18.25 v26.04,18.41 C4.1 | U1.17 23.52,14.71 23.62,14.61 v24.13,14.61 24.38,14.86 C6.1 | U1.59 14.84,19.45 | 14.84,19.45 14.48,19.81 C3.1 C2.1 | 14.84,19.45 v14.86,19.43 | C7.1 15.49,22.86 v15.62,22.73 16.1,22.25 U1.52 | C8.1 23.88,24.13 v23.62,23.88 23.52,23.77 U1.35 | U2.3 14.29,31.69 14.35,31.75 15.24,31.75 15.42,31.93 C14.1 16.26,31.24 16.19,31.18 U2.1 | R14.2 109.35,5.08
  Top 0.254: J5.5 59.69,12.7 60.07,12.32 60.07,6.1 60.45,5.71 84.33,5.71 84.84,6.22 89.92,6.22 91.06,5.08 109.35,5.08 112.78,5.08 113.03,4.83 J2.2 | v20.07,29.08 17.4,29.08 17.02,29.46 17.02,30.23 16.76,30.48 16.22,30.48 U2.1 | J7.3 12.45,29.21 12.83,29.59 12.83,30.1 13.24,30.51 U2.3 | F1.2 21.46,32.13 v21.08,31.75
  Top 0.406: F1.2 29.59,32.13 30.48,33.02 J6.2
  Bottom 0.254: v20.07,23.75 20.07,25.91 19.56,26.42 19.56,27.05 20.07,27.56 v20.07,29.08 20.07,31.24 20.45,31.62 20.95,31.62 v21.08,31.75 | 20.19,23.88 v20.07,23.75 | v23.62,23.88 23.62,21.46 23.88,21.21 | 23.88,21.21 24,21.08 25.53,21.08 26.04,20.57 v26.04,18.41 26.04,15.62 | v24.13,14.61 25.02,14.61 26.04,15.62 | 26.04,15.62 30.1,15.62 J5.5 | v20.07,23.75 19.05,22.73 v15.62,22.73 15.62,21.59 14.48,20.45 14.48,19.81 v14.86,19.43 | v20.07,23.75 20.07,21.21 20.45,20.83 23.5,20.83 23.88,21.21
BACK  (via drill 0.25)
  Top 0.406: R4.2 v17.14,4.83
  pour Bottom: 12.7,7.62 arc-90 13.97,8.89 20.32,8.89 arc-90 21.59,7.62 21.59,2.54 arc-90 20.32,1.27 13.97,1.27 arc-90 12.7,2.54
CONTRAST
  Top 0.203: R14.1 110.49,4.23 | 110.49,4.23 R13.2 | J2.3 110.49,4.23
D+
  Top 0.203: R18.2 18.8,36.07 19.02,36.29 J3.D+
D-
  Top 0.203: R19.2 20.19,35.56 19.67,36.08 J3.D-
DOWN  (via drill 0.25)
  Top 0.406: R2.2 v37.47,4.83
  pour Bottom: 33.02,7.62 arc-90 34.29,8.89 40.64,8.89 arc-90 41.91,7.62 41.91,2.54 arc-90 40.64,1.27 34.29,1.27 arc-90 33.02,2.54
ENTER  (via drill 0.25)
  Top 0.406: R3.2 v27.3,4.83
  pour Bottom: 22.86,7.62 arc-90 24.13,8.89 30.48,8.89 arc-90 31.75,7.62 31.75,2.54 arc-90 30.48,1.27 24.13,1.27 arc-90 22.86,2.54
GND  (via drill 0.25, 0.38)
  Top 0.203: U1.25 20.72,18.65 U1.69 | U1.9 U1.69 | U1.8 19.92,18.65 U1.69 | U1.7 19.52,18.25 U1.69 | U1.5 18.72,17.45 U1.69 | U1.58 19.52,19.85 | C5.2 14.04,13.64 13.93,13.76 C1.2 12.1,13.76 v12.06,13.72 | C12.2 v28.19,19.81 | C4.2 v29.08,18.41 | C8.2 v26.8,24.13 | C10.2 C9.2 | C9.2 C11.2 | C9.2 v20.19,26.8 | C7.2 v12.32,22.86 | C2.2 C3.2 v11.81,19.81 | C6.2 v27.56,14.86 | U2.2 v15.24,29.21 | R9.2 v45.09,27.69 | JP1.1 v58.42,20.32 | C13.2 v13.84,26.42 | C14.2 15.31,33.09 v15.24,33.02 | U1.43 U1.69 | U1.45 19.52,19.85 | 19.52,19.85 U1.69 | v22.73,21.46 U1.69 | R12.2 v35.56,28.57 | R13.1 115.36,5.93 115.57,5.71 J2.1
  Top 0.254: J3.GND 17.72,36.01 v17.53,35.81
  other vias: 20.32,19.05 18.8,17.14 22.23,17.14 17.91,21.46 11.43,8.89 22.23,8.89 32.38,8.89 42.55,8.89 52.07,8.89
  pour Top (hatched): 11.43,1.27 11.43,8.89 52.07,8.89 52.07,1.27
  pour Bottom (rank 2): 123.19,0 2.54,0 arc-90 0,2.54 0,39.37 arc-90 2.54,41.91 123.19,41.91 arc-90 125.73,39.37 125.73,2.54 arc-90
GND-ISO
  Top 0.203: R8.P$1 80.52,12.7 80.77,12.45 80.77,10.41 80.52,10.16 61.59,10.16 60.96,10.79 60.96,16.51 60.58,16.89 31.88,16.89 31.37,16.38 30.73,16.38 30.35,16.76 25.4,16.76 24.89,16.25 U1.19
  Top 0.254: 60.71,20.32 JP1.2
  Top 1.27: R8.P$1 64.77,12.7 62.23,15.24 62.23,20.32 | 62.23,20.32 62.23,26.54 J4.2 | 62.23,20.32 60.71,20.32
I_SENSE_HIGH
  Top 0.203: R7.P$2 95.5,12.7 95.76,12.45 95.76,10.16 95.38,9.78 61.34,9.78 60.58,10.54 60.58,16.26 60.33,16.51 32.13,16.51 31.62,16 30.48,16 30.1,16.38 25.78,16.38 25.25,15.85 U1.18
  Top 1.27: Q1.3 88.9,16.51 92.71,12.7 R7.P$2
I_SET  (via drill 0.25)
  Top 0.203: Q1.1 93.98,29.08 93.22,29.84 84.84,29.84 83.19,28.19 83.19,25.78 82.8,25.4 68.2,25.4 67.82,25.78 67.82,28.07 67.56,28.32 60.96,28.32 58.29,30.99 v24.13,30.99 | U1.37 22.72,26.53 v22.86,26.67
  Bottom 0.203: v22.86,26.67 22.86,29.72 v24.13,30.99
I_SET_SUM  (via drill 0.25)
  Top 0.203: R6.2 R5.2 v45.21,21.59 | U1.32 25.89,21.45 26.04,21.59 v26.04,21.72
  Bottom 0.203: v26.04,21.72 26.04,29.46 26.29,29.72 37.85,29.72 38.1,29.46 38.1,20.95 38.35,20.7 44.96,20.7 45.21,20.95 v45.21,21.59
LCD_D4  (via drill 0.25)
  Top 0.203: U1.49 17.92,27.06 18.29,27.43 v30.86,27.43 | v54.36,3.81 73.41,3.81 74.04,4.45 89.92,4.45 v90.17,4.7
  Bottom 0.203: v30.86,27.43 32.26,27.43 32.51,27.18 32.51,15.75 33.02,15.24 34.29,15.24 34.92,14.61 34.92,10.79 35.69,10.03 52.2,10.03 53.34,8.89 53.34,4.83 v54.36,3.81 | v90.17,4.7 J2.11
LCD_D5  (via drill 0.25)
  Top 0.203: U1.50 17.52,27.43 17.91,27.81 30.23,27.81 30.61,28.19 v30.86,28.19 | v54.36,4.7 54.86,4.19 73.28,4.19 73.91,4.83 87.38,4.83 v87.63,5.08
  Bottom 0.203: v30.86,28.19 32.64,28.19 32.89,27.94 32.89,16 33.27,15.62 34.54,15.62 35.31,14.86 35.31,10.92 35.81,10.41 52.32,10.41 53.72,9.02 53.72,4.95 53.98,4.7 v54.36,4.7 | v87.63,5.08 J2.12
LCD_D6  (via drill 0.25)
  Top 0.203: U1.51 17.12,28.04 17.27,28.19 29.97,28.19 30.73,28.96 v30.86,28.96 | v54.36,5.46 54.48,5.46 55.37,4.57 73.15,4.57 73.79,5.21 84.71,5.21 v85.09,5.59
  Bottom 0.203: v30.86,28.96 32.77,28.96 33.27,28.45 33.27,16.26 33.53,16 34.8,16 35.69,15.11 35.69,11.05 35.94,10.79 52.45,10.79 54.1,9.14 54.1,5.71 v54.36,5.46 | v85.09,5.59 J2.13
LCD_D7
  Top 0.203: U1.53 8.77,21.85 8.26,21.34 8.26,1.65 8.76,1.14 74.93,1.14 75.44,1.65 75.44,2.67 75.69,2.92 80.9,2.92 J2.14
LCD_E
  Top 0.203: U1.54 9,21.45 8.64,21.08 8.64,2.03 9.14,1.52 74.55,1.52 75.06,2.03 75.06,3.05 75.31,3.3 102.62,3.3 102.87,3.05 J2.6
LCD_RS
  Top 0.203: U1.55 9.24,21.05 9.02,20.83 9.02,2.41 9.53,1.91 74.17,1.91 74.68,2.41 74.68,3.43 74.93,3.68 107.44,3.68 107.95,3.17 J2.4
LCD_RW  (via drill 0.3)
  Top 0.203: U1.56 9.6,20.65 9.4,20.45 9.4,2.67 9.78,2.29 73.79,2.29 74.3,2.79 74.3,3.81 74.55,4.06 105.16,4.06 v105.41,4.32
  Bottom 0.203: v105.41,4.32 J2.5
N$1  (via drill 0.25)
  Top 0.203: U1.65 14.64,17.05 14.61,17.02 13.84,17.02 v13.59,17.27 | v20.32,11.18 20.32,10.67 20.45,10.54 47.24,10.54 47.62,10.16 R1.1
  Bottom 0.203: v13.59,17.27 13.84,17.02 16.51,17.02 16.64,16.89 16.64,11.43 16.89,11.18 v20.32,11.18
N$2  (via drill 0.25)
  Top 0.203: U1.64 14.43,17.45 v14.35,17.53 | v19.68,11.81 19.68,10.16 19.81,10.03 36.7,10.03 37.47,9.27 R2.1
  Bottom 0.203: v14.35,17.53 16.89,17.53 17.14,17.27 17.14,11.94 17.53,11.56 19.43,11.56 v19.68,11.81
N$3  (via drill 0.25)
  Top 0.203: U1.63 15.04,17.85 v14.73,18.16 | v18.8,12.19 18.8,9.91 19.18,9.53 26.92,9.53 27.3,9.14 R3.1
  Bottom 0.203: v14.73,18.16 14.99,17.91 17.4,17.91 17.53,17.78 17.53,12.45 17.78,12.19 v18.8,12.19
N$4  (via drill 0.25)
  Top 0.203: U1.62 15.66,18.25 v15.37,18.54 | v18.16,12.7 18.16,10.29 17.14,9.27 R4.1
  Bottom 0.203: v18.16,12.7 18.16,18.67 17.78,19.05 15.62,19.05 15.37,18.8 v15.37,18.54
N$5
  Top 0.203: C1.1 13.08,16.51 13.21,16.64 15.24,16.64 | 15.24,16.64 15.37,16.64 | U1.66 15.25,16.65 15.24,16.64
N$6  (via drill 0.25, 0.3)
  Top 0.203: U1.57 15.55,20.25 v15.37,20.07 | U1.26 v25.02,19.05 25.02,19.68 25.15,19.81 C12.1
  Bottom 0.203: v25.02,19.05 24,20.07 v15.37,20.07
N$7
  Top 0.203: U1.42 20.72,23.51 20.95,23.75 21.34,23.75 21.59,24 C11.1
N$8  (via drill 0.25)
  Top 0.203: R18.1 18.8,30.86 19.68,29.97 31.24,29.97 31.5,29.72 31.5,23.37 30.99,22.86 30.99,21.59 31.5,21.08 31.5,18.8 v31.11,18.41 | v31.11,17.02 30.73,17.02 30.48,17.27 26.29,17.27 26.11,17.45 U1.22
  Bottom 0.203: v31.11,18.41 v31.11,17.02
N$9
  Top 0.203: U1.23 26.35,17.85 26.54,17.65 31.75,17.65 31.88,17.78 31.88,21.21 31.37,21.72 31.37,22.73 31.88,23.24 31.88,30.1 31.62,30.35 20.83,30.35 20.19,30.99 R19.1
N$10  (via drill 0.25, 0.3)
  Top 0.203: U1.48 18.32,23.65 18.41,23.75 v19.05,23.75 | v40.51,21.59 R5.1
  Bottom 0.203: v19.05,23.75 19.05,32.13 19.43,32.51 39.88,32.51 40.26,32.13 40.26,21.84 v40.51,21.59
N$11  (via drill 0.25)
  Top 0.203: U1.36 23.12,26.17 v23.62,26.67 | v39.75,23.11 R6.1
  Bottom 0.203: v23.62,26.67 23.62,29.72 24.38,30.48 39.24,30.48 39.75,29.97 v39.75,23.11
N$12  (via drill 0.25)
  Top 0.203: U1.29 25.08,20.25 25.15,20.32 25.15,20.7 25.27,20.83 29.97,20.83 30.1,20.95 v30.1,22.23 | v32,22.23 33.4,22.23 33.66,21.97 33.66,19.94 33.8,19.79 D1.A
  Bottom 0.203: v30.1,22.23 v32,22.23
N$13
  Top 0.203: R12.1 D1.C
N$14
  Top 0.254: 20.45,36.7 20.32,36.83 J3.VBUS
  Top 0.406: F1.1 21.34,34.93 21.34,34.92 21.21,35.05 21.21,35.69 20.45,36.45 20.45,36.7
N$15
  Top 0.203: R10.1 42.33,23.96 42.42,23.88 59.69,23.88 59.94,24.13 59.94,27.56 60.33,27.94 64.14,27.94 64.52,27.56 64.52,26.92 64.77,26.67 J4.1
  Top 1.27: J4.1 66.22,24.97 66.93,24.26 83.82,24.26 84.45,24.89 84.45,27.69 85.34,28.57 90.55,28.57 91.44,27.69 Q1.2
N$16
  Top 0.203: R11.1 R10.2
N$18
  Top 1.27: R8.P$2 R7.P$1
RXI  (via drill 0.25)
  Top 0.203: U1.3 17.92,14.36 17.02,13.46 17.02,12.32 16.13,11.43 11.18,11.43 v10.92,11.18
  Bottom 0.203: v10.92,11.18 10.92,12.95 10.54,13.34 7.37,13.34 7.11,13.59 7.11,26.16 6.6,26.67 J7.2
SHIELD  (via drill 0.38)
  Top 0.254: J3.SHIELD3 21.5,40.34 J3.P$12 | J3.P$8 16.35,37.61 J3.P$10 | J3.P$6 21.42,39.84 J3.P$12 | J3.P$10 | J3.P$10 J3.P$2 16.55,37.38 J3.SHEILD2 | J3.SHIELD J3.P$6 | J3.P$8 J3.P$12 | J3.P$10 16.57,39.91 J3.P$8 | J3.P$10 14.68,37.39 v13.97,38.1 | J3.P$6 23.41,37.38 v24.13,38.1
  Bottom 0.254: J3.P$6 20.32,37.38 | 20.32,37.38 J3.P$10 20.31,37.39 20.32,37.38
  other vias: 13.97,40.64 24.13,40.64
  pour Top: 12.7,41.91 12.7,36.83 25.4,36.83 25.4,41.91
  pour Bottom: 12.7,41.91 12.7,36.83 25.4,36.83 25.4,41.91
SWDCK
  Top 0.203: U1.12 21.52,14.68 21.84,14.35 22.86,14.35 23.24,13.97 24.13,13.97 J5.2
SWDIO
  Top 0.203: U1.11 21.12,14.44 J5.1
TXO  (via drill 0.25)
  Top 0.203: U1.4 18.32,14.13 17.53,13.34 17.53,12.19 16.26,10.92 11.81,10.92 v11.68,10.79 | v7.87,24.13 J7.1
  Bottom 0.203: v11.68,10.79 11.68,12.83 10.67,13.84 8.13,13.84 7.87,14.1 v7.87,24.13
UP  (via drill 0.25)
  Top 0.406: R1.2 v47.62,4.83
  pour Bottom: 43.18,7.62 arc-90 44.45,8.89 50.8,8.89 arc-90 52.07,7.62 52.07,2.54 arc-90 50.8,1.27 44.45,1.27 arc-90 43.18,2.54
V_SENSE  (via drill 0.25)
  Top 0.203: R11.2 R9.1 v38.86,27.69 | U1.33 24.77,21.85 v25.4,22.48
  Bottom 0.203: v25.4,22.48 25.4,29.84 25.65,30.1 38.99,30.1 39.37,29.72 39.37,28.19 v38.86,27.69
XRES
  Top 0.203: U1.10 20.72,13.57 21.59,12.7 21.59,12.06 22.23,11.43 26.67,11.43 J5.3

### Text on the board
Bottom: v11
tPlace: GND | 5V | GND | LOAD_GND | LOAD_POS | 5V | RXI | TXO | DO NOT CUT | 5V | SWD | RES | GND | SWCK | Variable Load
bPlace: LOAD_ON | Variable Load | BACK | ENTER
Measures: typ. | typ. | Dimensions In Inches
tDocu: Mike Hord